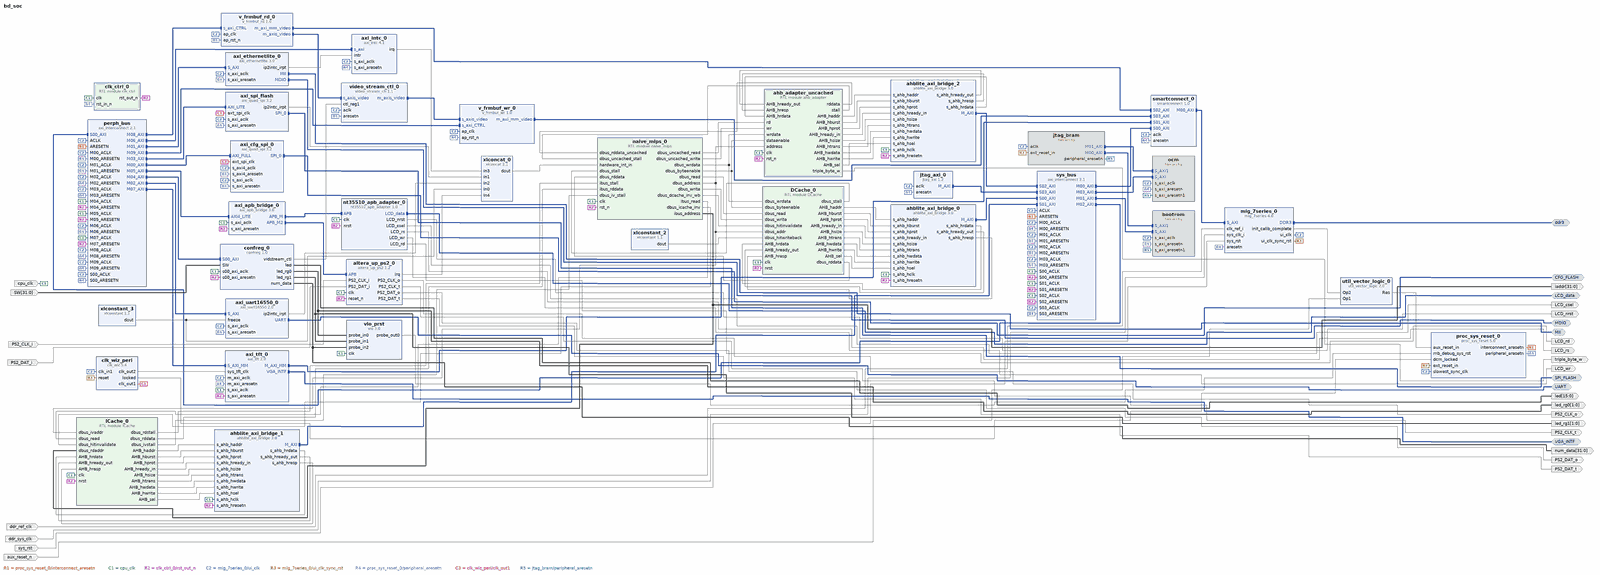
[diagram p0: block diagram of the top level, whole]
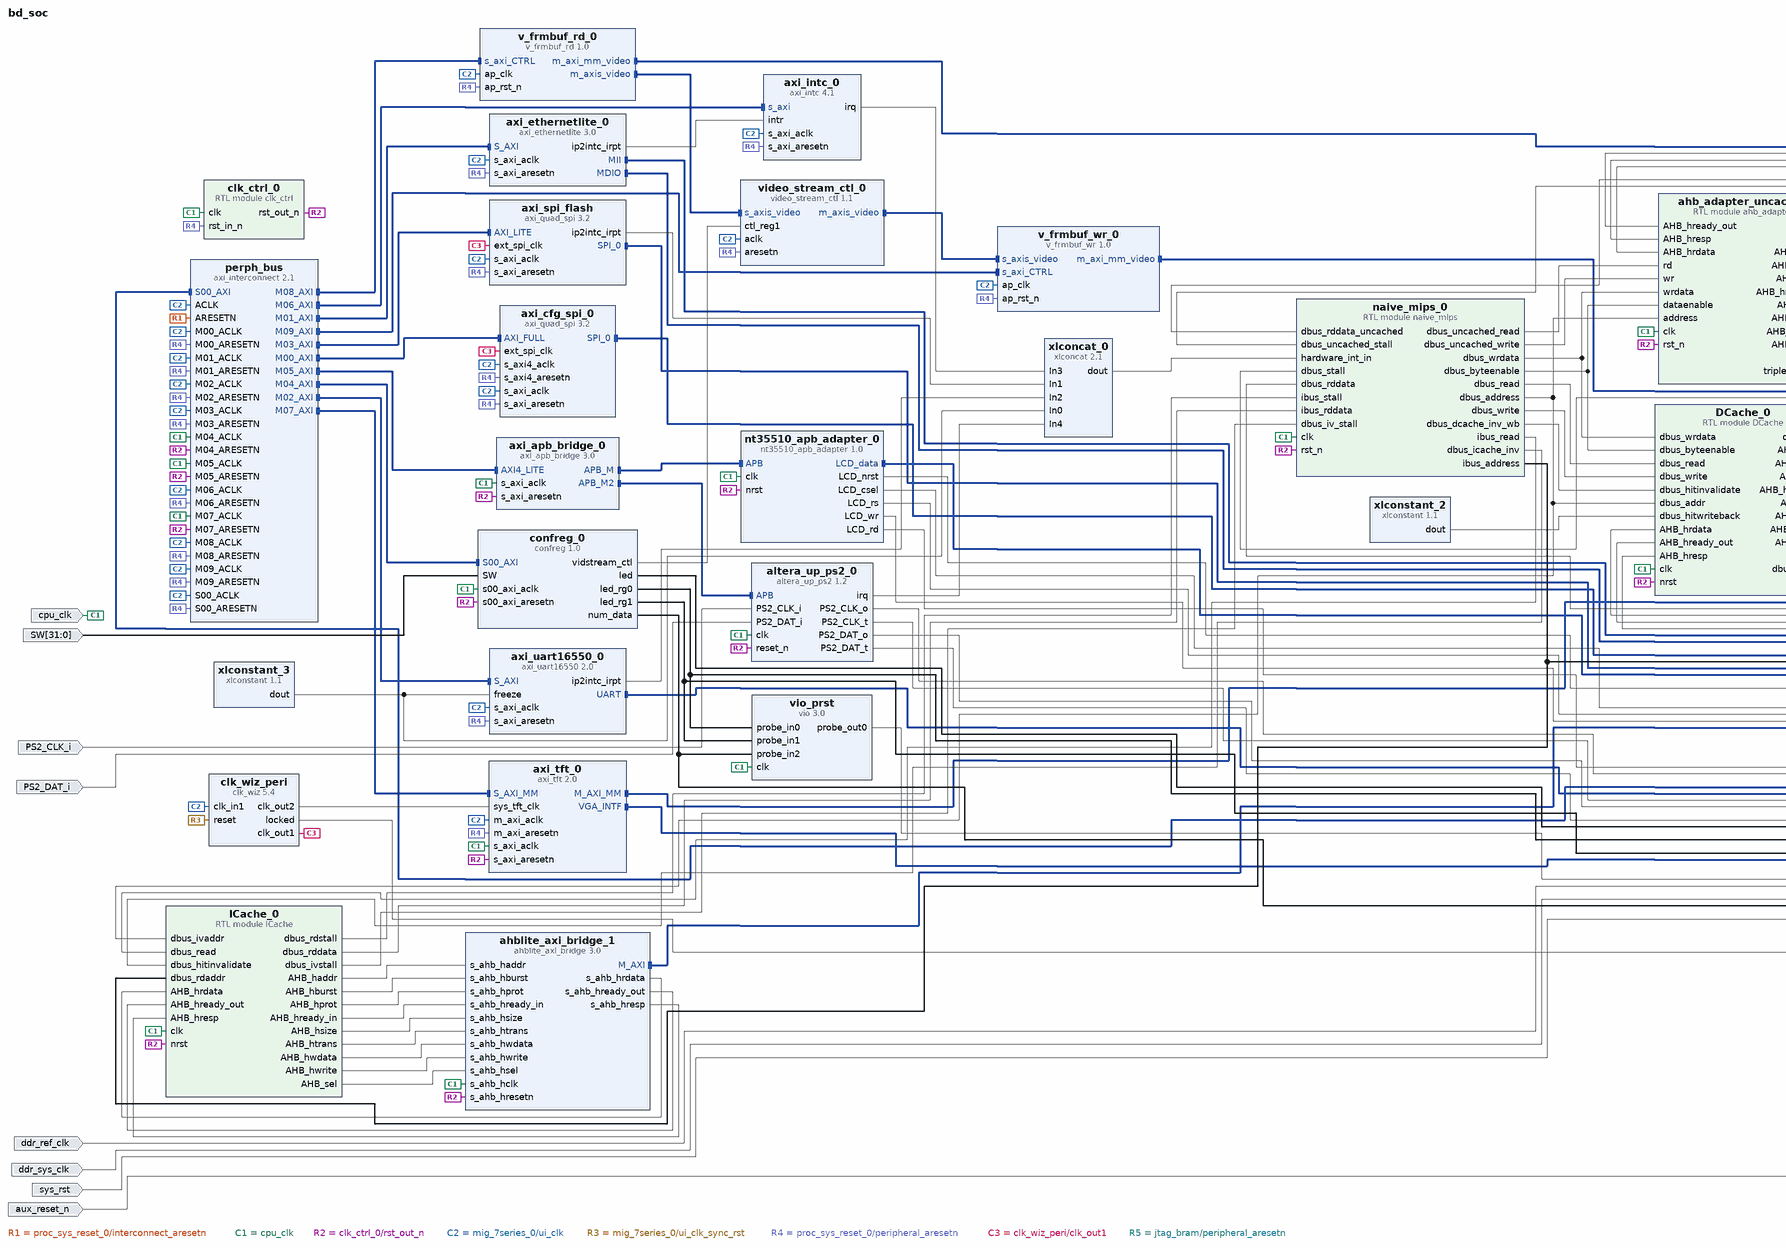
[diagram p1: block diagram of the top level, left part]
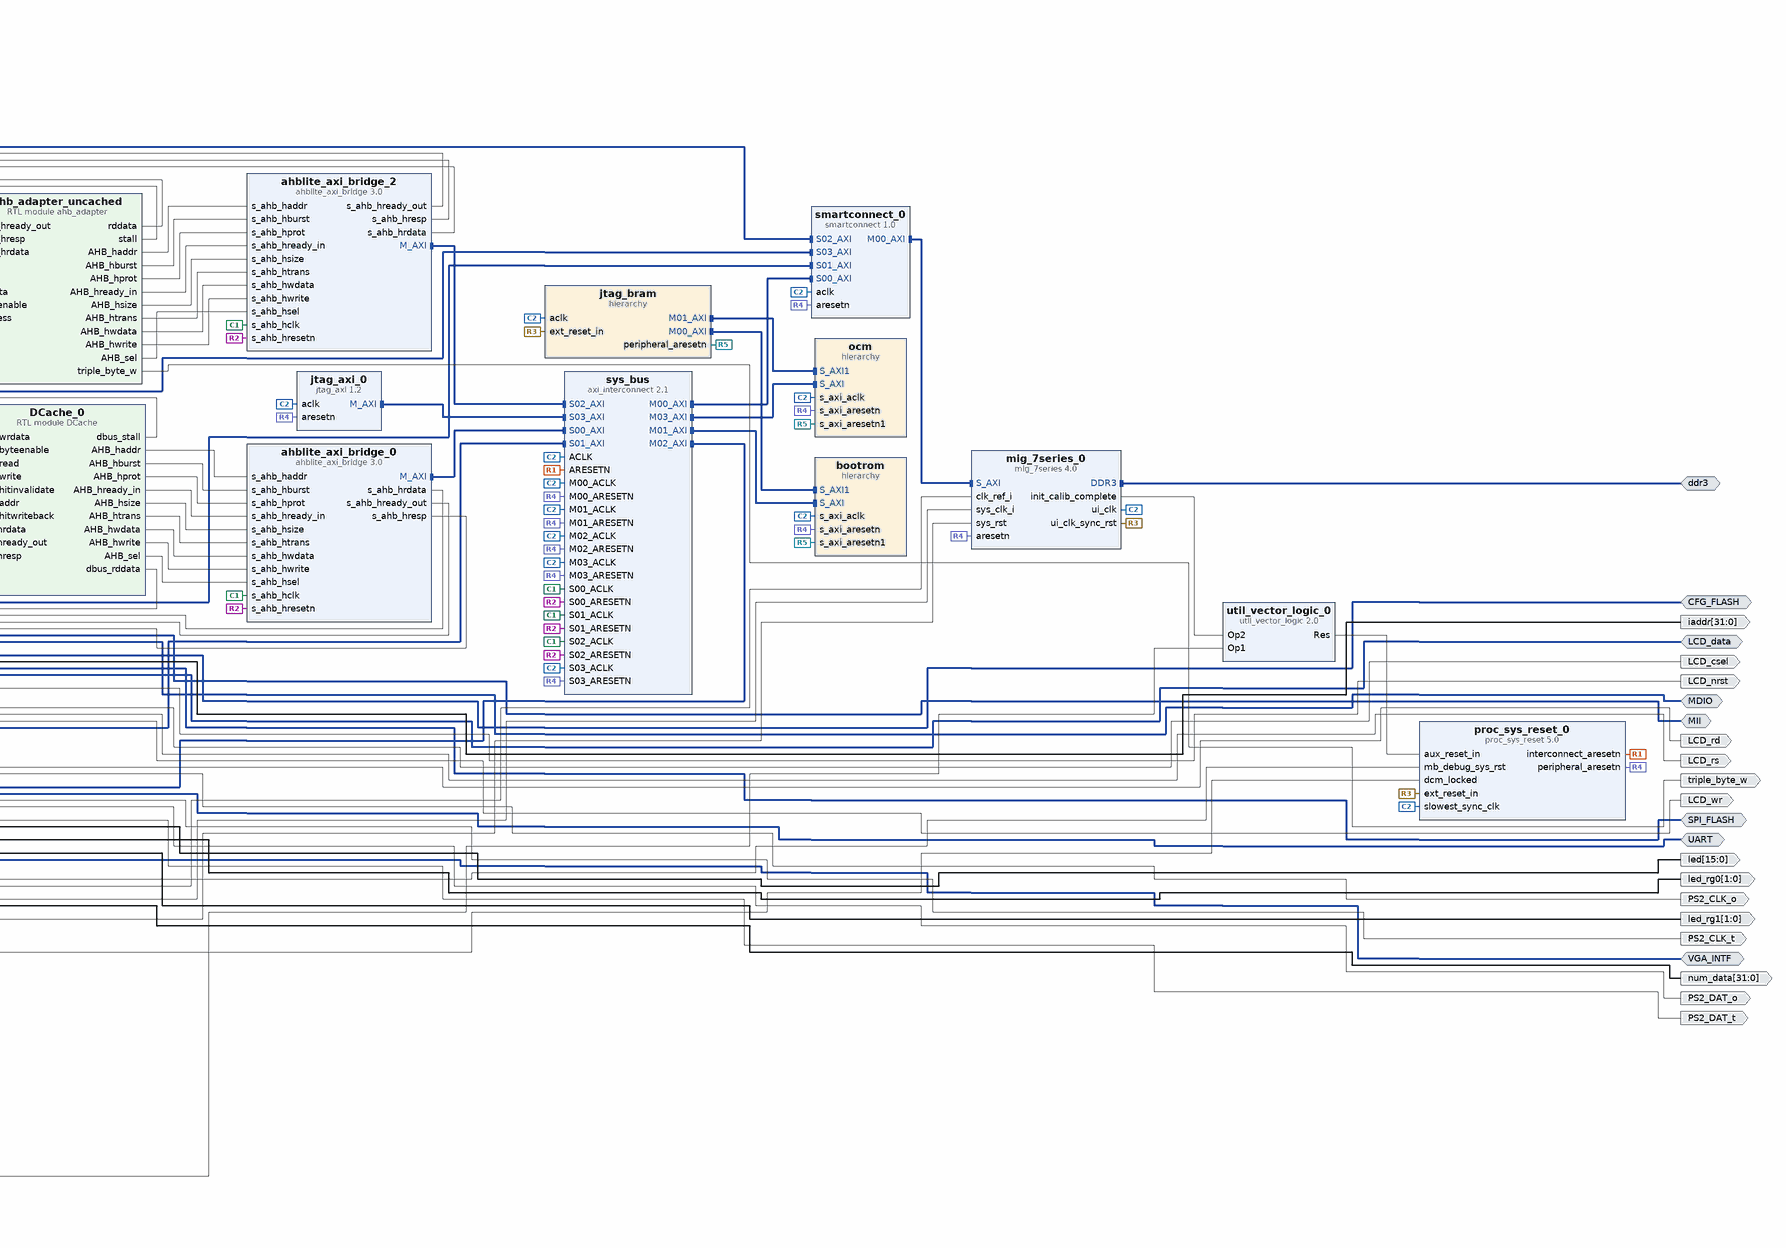
[diagram p2: block diagram of the top level, right part]
# Vivado block design bd_soc, xc7a200tfbg676-2, Vivado 2017.1
create_bd_design bd_soc

create_bd_intf_port -mode Master -vlnv xilinx.com:interface:ddrx_rtl:1.0 ddr3
create_bd_intf_port -mode Master -vlnv xilinx.com:interface:mii_rtl:1.0 MII
create_bd_intf_port -mode Master -vlnv xilinx.com:interface:mdio_rtl:1.0 MDIO
create_bd_intf_port -mode Master -vlnv xilinx.com:interface:uart_rtl:1.0 UART
create_bd_intf_port -mode Master -vlnv xilinx.com:interface:spi_rtl:1.0 SPI_FLASH
create_bd_intf_port -mode Master -vlnv xilinx.com:interface:spi_rtl:1.0 CFG_FLASH
create_bd_intf_port -mode Master -vlnv xilinx.com:interface:gpio_rtl:1.0 LCD_data
create_bd_intf_port -mode Master -vlnv xilinx.com:interface:vga_rtl:1.0 VGA_INTF
create_bd_port -dir I -type clk cpu_clk
set_property -dict {CONFIG.FREQ_HZ 50000000} [get_bd_ports cpu_clk]
create_bd_port -dir I -type clk ddr_ref_clk
set_property -dict {CONFIG.FREQ_HZ 200000000} [get_bd_ports ddr_ref_clk]
create_bd_port -dir I -type clk ddr_sys_clk
create_bd_port -dir I -type rst sys_rst
set_property -dict {CONFIG.POLARITY ACTIVE_HIGH} [get_bd_ports sys_rst]
create_bd_port -dir I -type rst aux_reset_n
create_bd_port -dir O -from 31 -to 0 iaddr
create_bd_port -dir O triple_byte_w
create_bd_port -dir O LCD_nrst
create_bd_port -dir O LCD_csel
create_bd_port -dir O LCD_rs
create_bd_port -dir O LCD_wr
create_bd_port -dir O LCD_rd
create_bd_port -dir I PS2_CLK_i
create_bd_port -dir I PS2_DAT_i
create_bd_port -dir O PS2_CLK_o
create_bd_port -dir O PS2_CLK_t
create_bd_port -dir O PS2_DAT_o
create_bd_port -dir O PS2_DAT_t
create_bd_port -dir O -from 15 -to 0 led
create_bd_port -dir O -from 1 -to 0 led_rg0
create_bd_port -dir O -from 1 -to 0 led_rg1
create_bd_port -dir O -from 31 -to 0 num_data
create_bd_port -dir I -from 31 -to 0 SW

create_bd_cell -type module -reference clk_ctrl clk_ctrl_0
create_bd_cell -type hier bootrom
create_bd_cell -type hier ocm
create_bd_cell -type hier jtag_bram
create_bd_cell -type module -reference DCache DCache_0
set_property -dict {CONFIG.CACHE_LINE_WIDTH 6 CONFIG.TAG_WIDTH 18} [get_bd_cells DCache_0]
create_bd_cell -type module -reference ICache ICache_0
set_property -dict {CONFIG.CACHE_LINE_WIDTH 6 CONFIG.TAG_WIDTH 19} [get_bd_cells ICache_0]
create_bd_cell -type module -reference ahb_adapter ahb_adapter_uncached
create_bd_cell -type ip -vlnv xilinx.com:ip:ahblite_axi_bridge:3.0 ahblite_axi_bridge_0
set_property -dict {CONFIG.C_M_AXI_THREAD_ID_WIDTH 4 CONFIG.C_M_AXI_SUPPORTS_NARROW_BURST 1} [get_bd_cells ahblite_axi_bridge_0]
create_bd_cell -type ip -vlnv xilinx.com:ip:ahblite_axi_bridge:3.0 ahblite_axi_bridge_1
set_property -dict {CONFIG.C_M_AXI_SUPPORTS_NARROW_BURST 1} [get_bd_cells ahblite_axi_bridge_1]
create_bd_cell -type ip -vlnv xilinx.com:ip:ahblite_axi_bridge:3.0 ahblite_axi_bridge_2
create_bd_cell -type ip -vlnv xilinx.com:ip:axi_apb_bridge:3.0 axi_apb_bridge_0
set_property -dict {CONFIG.C_M_APB_PROTOCOL apb4 CONFIG.C_APB_NUM_SLAVES 2} [get_bd_cells axi_apb_bridge_0]
create_bd_cell -type ip -vlnv xilinx.com:ip:axi_ethernetlite:3.0 axi_ethernetlite_0
create_bd_cell -type ip -vlnv xilinx.com:ip:axi_intc:4.1 axi_intc_0
set_property -dict {CONFIG.C_PROCESSOR_CLK_FREQ_MHZ 40.0 CONFIG.C_IRQ_CONNECTION 1} [get_bd_cells axi_intc_0]
create_bd_cell -type ip -vlnv xilinx.com:ip:axi_interconnect:2.1 perph_bus
set_property -dict [list \
  CONFIG.NUM_SI 1 \
  CONFIG.NUM_MI 10 \
  CONFIG.M00_HAS_REGSLICE 3 \
  CONFIG.M01_HAS_REGSLICE 3 \
  CONFIG.M02_HAS_REGSLICE 3 \
  CONFIG.M03_HAS_REGSLICE 3 \
  CONFIG.M04_HAS_REGSLICE 3 \
  CONFIG.M05_HAS_REGSLICE 3 \
  CONFIG.M06_HAS_REGSLICE 3 \
  CONFIG.M07_HAS_REGSLICE 3 \
  CONFIG.M08_HAS_REGSLICE 3 \
  CONFIG.M09_HAS_REGSLICE 3 \
  CONFIG.S00_HAS_REGSLICE 3 \
] [get_bd_cells perph_bus]
create_bd_cell -type ip -vlnv xilinx.com:ip:axi_interconnect:2.1 sys_bus
set_property -dict [list \
  CONFIG.NUM_SI 4 \
  CONFIG.NUM_MI 4 \
  CONFIG.STRATEGY 2 \
  CONFIG.M02_HAS_REGSLICE 3 \
  CONFIG.S03_HAS_REGSLICE 3 \
  CONFIG.S00_HAS_DATA_FIFO 2 \
  CONFIG.S01_HAS_DATA_FIFO 2 \
  CONFIG.S02_HAS_DATA_FIFO 2 \
  CONFIG.S03_HAS_DATA_FIFO 2 \
] [get_bd_cells sys_bus]
create_bd_cell -type ip -vlnv xilinx.com:ip:axi_quad_spi:3.2 axi_cfg_spi_0
set_property -dict {CONFIG.C_SPI_MEMORY 3 CONFIG.C_XIP_MODE 1 CONFIG.C_TYPE_OF_AXI4_INTERFACE 1} [get_bd_cells axi_cfg_spi_0]
create_bd_cell -type ip -vlnv xilinx.com:ip:axi_quad_spi:3.2 axi_spi_flash
set_property -dict [list \
  CONFIG.C_SPI_MEMORY 3 \
  CONFIG.C_USE_STARTUP 0 \
  CONFIG.C_SPI_MODE 2 \
  CONFIG.C_FIFO_DEPTH 256 \
  CONFIG.C_TYPE_OF_AXI4_INTERFACE 0 \
  CONFIG.C_S_AXI4_ID_WIDTH 0 \
] [get_bd_cells axi_spi_flash]
create_bd_cell -type ip -vlnv xilinx.com:ip:axi_tft:2.0 axi_tft_0
set_property -dict {CONFIG.C_MAX_BURST_LEN 128 CONFIG.C_EN_I2C_INTF 0 CONFIG.C_TFT_INTERFACE 0} [get_bd_cells axi_tft_0]
create_bd_cell -type ip -vlnv xilinx.com:ip:axi_uart16550:2.0 axi_uart16550_0
create_bd_cell -type ip -vlnv xilinx.com:ip:clk_wiz:5.4 clk_wiz_peri
set_property -dict [list \
  CONFIG.CLKOUT2_USED true \
  CONFIG.NUM_OUT_CLKS 2 \
  CONFIG.CLKOUT1_REQUESTED_OUT_FREQ 60.000 \
  CONFIG.CLKOUT2_REQUESTED_OUT_FREQ 25 \
  CONFIG.MMCM_DIVCLK_DIVIDE 1 \
  CONFIG.MMCM_CLKFBOUT_MULT_F 9.750 \
  CONFIG.MMCM_CLKOUT0_DIVIDE_F 16.250 \
  CONFIG.MMCM_CLKOUT1_DIVIDE 39 \
  CONFIG.CLKOUT1_JITTER 144.725 \
  CONFIG.CLKOUT1_PHASE_ERROR 99.281 \
  CONFIG.CLKOUT2_JITTER 174.188 \
  CONFIG.CLKOUT2_PHASE_ERROR 99.281 \
] [get_bd_cells clk_wiz_peri]
create_bd_cell -type ip -vlnv xilinx.com:ip:jtag_axi:1.2 jtag_axi_0
create_bd_cell -type ip -vlnv xilinx.com:ip:mig_7series:4.0 mig_7series_0
set_property -dict [list \
  CONFIG.XML_INPUT_FILE mig_b.prj \
  CONFIG.RESET_BOARD_INTERFACE Custom \
  CONFIG.BOARD_MIG_PARAM Custom \
] [get_bd_cells mig_7series_0]
create_bd_cell -type ip -vlnv xilinx.com:ip:proc_sys_reset:5.0 proc_sys_reset_0
set_property -dict {CONFIG.C_AUX_RESET_HIGH 0} [get_bd_cells proc_sys_reset_0]
create_bd_cell -type ip -vlnv xilinx.com:ip:util_vector_logic:2.0 util_vector_logic_0
create_bd_cell -type ip -vlnv xilinx.com:ip:vio:3.0 vio_prst
set_property -dict [list \
  CONFIG.C_PROBE_OUT0_INIT_VAL 0x0 \
  CONFIG.C_EN_PROBE_IN_ACTIVITY 0 \
  CONFIG.C_NUM_PROBE_IN 3 \
] [get_bd_cells vio_prst]
create_bd_cell -type ip -vlnv xilinx.com:ip:xlconcat:2.1 xlconcat_0
set_property -dict {CONFIG.NUM_PORTS 5 CONFIG.dout_width 5} [get_bd_cells xlconcat_0]
create_bd_cell -type ip -vlnv xilinx.com:ip:xlconstant:1.1 xlconstant_2
set_property -dict {CONFIG.CONST_VAL 0} [get_bd_cells xlconstant_2]
create_bd_cell -type ip -vlnv xilinx.com:ip:xlconstant:1.1 xlconstant_3
set_property -dict {CONFIG.CONST_VAL 0} [get_bd_cells xlconstant_3]
create_bd_cell -type ip -vlnv xilinx.com:ip:smartconnect:1.0 smartconnect_0
set_property -dict {CONFIG.NUM_SI 4} [get_bd_cells smartconnect_0]
create_bd_cell -type ip -vlnv xilinx.com:ip:v_frmbuf_rd:1.0 v_frmbuf_rd_0
set_property -dict [list \
  CONFIG.C_M_AXI_MM_VIDEO_DATA_WIDTH 64 \
  CONFIG.SAMPLES_PER_CLOCK 1 \
  CONFIG.MAX_COLS 1024 \
  CONFIG.MAX_ROWS 768 \
  CONFIG.AXIMM_DATA_WIDTH 64 \
  CONFIG.HAS_RGBX8 1 \
  CONFIG.HAS_RGB8 0 \
] [get_bd_cells v_frmbuf_rd_0]
create_bd_cell -type ip -vlnv xilinx.com:ip:v_frmbuf_wr:1.0 v_frmbuf_wr_0
set_property -dict [list \
  CONFIG.C_M_AXI_MM_VIDEO_DATA_WIDTH 64 \
  CONFIG.SAMPLES_PER_CLOCK 1 \
  CONFIG.MAX_COLS 1024 \
  CONFIG.MAX_ROWS 768 \
  CONFIG.AXIMM_DATA_WIDTH 64 \
  CONFIG.HAS_RGBX8 1 \
  CONFIG.HAS_RGB8 0 \
] [get_bd_cells v_frmbuf_wr_0]
create_bd_cell -type ip -vlnv user.org:user:confreg:1.0 confreg_0
create_bd_cell -type module -reference naive_mips naive_mips_0
set_property -dict {CONFIG.WITH_CACHE 1 CONFIG.WITH_TLB 1 CONFIG.BUS_READ_1CYCLE 1} [get_bd_cells naive_mips_0]
create_bd_cell -type ip -vlnv user.org:user:video_stream_ctl:1.1 video_stream_ctl_0
create_bd_cell -type ip -vlnv user.org:user:altera_up_ps2:1.2 altera_up_ps2_0
set_property -dict {CONFIG.CLK_FREQ 50000000} [get_bd_cells altera_up_ps2_0]
create_bd_cell -type ip -vlnv user.org:user:nt35510_apb_adapter:1.0 nt35510_apb_adapter_0

# ---- hierarchy /bootrom ----
current_bd_instance /bootrom
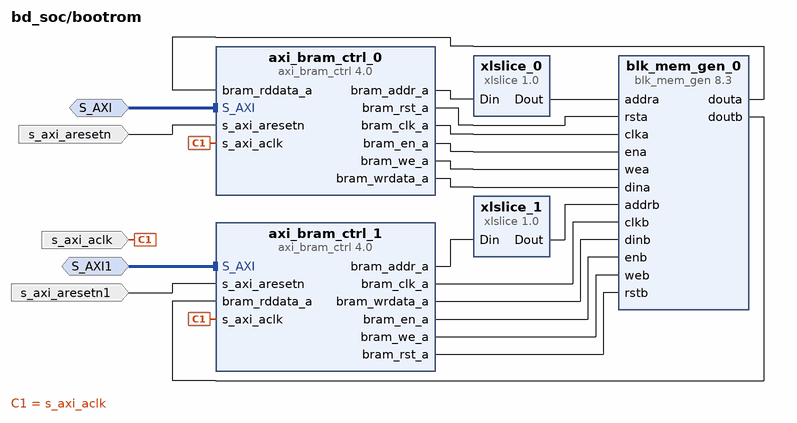
[diagram p3: block diagram inside /bootrom]
create_bd_intf_pin -mode Slave -vlnv xilinx.com:interface:aximm_rtl:1.0 S_AXI
create_bd_intf_pin -mode Slave -vlnv xilinx.com:interface:aximm_rtl:1.0 S_AXI1
create_bd_pin -dir I -type clk s_axi_aclk
create_bd_pin -dir I -type rst s_axi_aresetn
create_bd_pin -dir I -type rst s_axi_aresetn1

create_bd_cell -type ip -vlnv xilinx.com:ip:axi_bram_ctrl:4.0 axi_bram_ctrl_0
set_property -dict {CONFIG.SINGLE_PORT_BRAM 1} [get_bd_cells axi_bram_ctrl_0]
create_bd_cell -type ip -vlnv xilinx.com:ip:axi_bram_ctrl:4.0 axi_bram_ctrl_1
set_property -dict {CONFIG.SINGLE_PORT_BRAM 1} [get_bd_cells axi_bram_ctrl_1]
create_bd_cell -type ip -vlnv xilinx.com:ip:blk_mem_gen:8.3 blk_mem_gen_0
set_property -dict [list \
  CONFIG.Memory_Type True_Dual_Port_RAM \
  CONFIG.Enable_32bit_Address false \
  CONFIG.Use_Byte_Write_Enable true \
  CONFIG.Byte_Size 8 \
  CONFIG.Assume_Synchronous_Clk true \
  CONFIG.Write_Width_A 32 \
  CONFIG.Write_Depth_A 12288 \
  CONFIG.Read_Width_A 32 \
  CONFIG.Write_Width_B 32 \
  CONFIG.Read_Width_B 32 \
  CONFIG.Enable_B Use_ENB_Pin \
  CONFIG.Register_PortA_Output_of_Memory_Primitives false \
  CONFIG.Register_PortB_Output_of_Memory_Primitives false \
  CONFIG.Load_Init_File true \
  CONFIG.Coe_File ../../../../../../bootrom.coe \
  CONFIG.Fill_Remaining_Memory_Locations false \
  CONFIG.Use_RSTA_Pin true \
  CONFIG.Use_RSTB_Pin true \
  CONFIG.Port_B_Clock 100 \
  CONFIG.Port_B_Write_Rate 50 \
  CONFIG.Port_B_Enable_Rate 100 \
  CONFIG.use_bram_block Stand_Alone \
] [get_bd_cells blk_mem_gen_0]
create_bd_cell -type ip -vlnv xilinx.com:ip:xlslice:1.0 xlslice_0
set_property -dict {CONFIG.DIN_TO 2 CONFIG.DIN_FROM 15 CONFIG.DIN_WIDTH 16 CONFIG.DOUT_WIDTH 14} [get_bd_cells xlslice_0]
create_bd_cell -type ip -vlnv xilinx.com:ip:xlslice:1.0 xlslice_1
set_property -dict {CONFIG.DIN_TO 2 CONFIG.DIN_FROM 15 CONFIG.DIN_WIDTH 16 CONFIG.DOUT_WIDTH 14} [get_bd_cells xlslice_1]

# ---- hierarchy /ocm ----
current_bd_instance /ocm
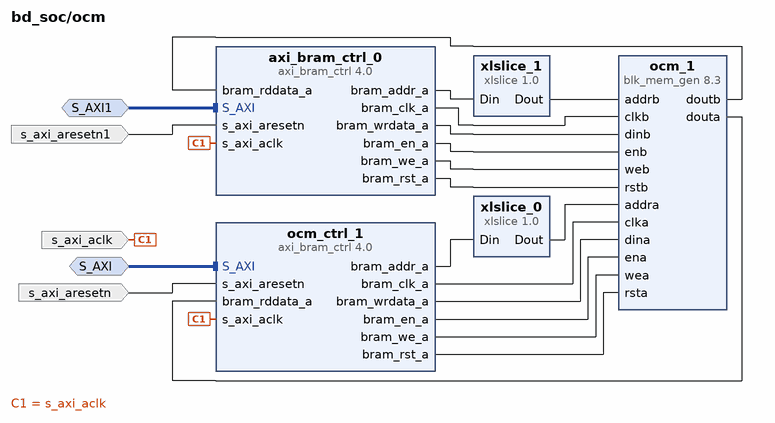
[diagram p4: block diagram inside /ocm]
create_bd_intf_pin -mode Slave -vlnv xilinx.com:interface:aximm_rtl:1.0 S_AXI
create_bd_intf_pin -mode Slave -vlnv xilinx.com:interface:aximm_rtl:1.0 S_AXI1
create_bd_pin -dir I -type clk s_axi_aclk
create_bd_pin -dir I -type rst s_axi_aresetn
create_bd_pin -dir I -type rst s_axi_aresetn1

create_bd_cell -type ip -vlnv xilinx.com:ip:axi_bram_ctrl:4.0 axi_bram_ctrl_0
set_property -dict {CONFIG.SINGLE_PORT_BRAM 1} [get_bd_cells axi_bram_ctrl_0]
create_bd_cell -type ip -vlnv xilinx.com:ip:axi_bram_ctrl:4.0 ocm_ctrl_1
set_property -dict {CONFIG.SINGLE_PORT_BRAM 1} [get_bd_cells ocm_ctrl_1]
create_bd_cell -type ip -vlnv xilinx.com:ip:blk_mem_gen:8.3 ocm_1
set_property -dict [list \
  CONFIG.Memory_Type True_Dual_Port_RAM \
  CONFIG.Enable_32bit_Address false \
  CONFIG.Use_Byte_Write_Enable true \
  CONFIG.Byte_Size 8 \
  CONFIG.Assume_Synchronous_Clk true \
  CONFIG.Write_Width_A 32 \
  CONFIG.Write_Depth_A 4096 \
  CONFIG.Read_Width_A 32 \
  CONFIG.Operating_Mode_A WRITE_FIRST \
  CONFIG.Write_Width_B 32 \
  CONFIG.Read_Width_B 32 \
  CONFIG.Enable_B Use_ENB_Pin \
  CONFIG.Register_PortA_Output_of_Memory_Primitives false \
  CONFIG.Register_PortB_Output_of_Memory_Primitives false \
  CONFIG.Use_RSTA_Pin true \
  CONFIG.Use_RSTB_Pin true \
  CONFIG.Port_B_Clock 100 \
  CONFIG.Port_B_Write_Rate 50 \
  CONFIG.Port_B_Enable_Rate 100 \
  CONFIG.use_bram_block Stand_Alone \
] [get_bd_cells ocm_1]
create_bd_cell -type ip -vlnv xilinx.com:ip:xlslice:1.0 xlslice_0
set_property -dict {CONFIG.DIN_TO 2 CONFIG.DIN_FROM 13 CONFIG.DIN_WIDTH 14 CONFIG.DOUT_WIDTH 12} [get_bd_cells xlslice_0]
create_bd_cell -type ip -vlnv xilinx.com:ip:xlslice:1.0 xlslice_1
set_property -dict {CONFIG.DIN_TO 2 CONFIG.DIN_FROM 13 CONFIG.DIN_WIDTH 14 CONFIG.DOUT_WIDTH 12} [get_bd_cells xlslice_1]

# ---- hierarchy /jtag_bram ----
current_bd_instance /jtag_bram
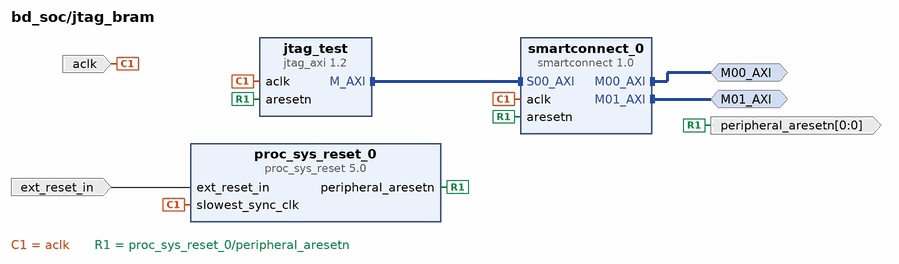
[diagram p5: block diagram inside /jtag_bram]
create_bd_intf_pin -mode Master -vlnv xilinx.com:interface:aximm_rtl:1.0 M00_AXI
create_bd_intf_pin -mode Master -vlnv xilinx.com:interface:aximm_rtl:1.0 M01_AXI
create_bd_pin -dir I -type clk aclk
create_bd_pin -dir O -from 0 -to 0 -type rst peripheral_aresetn
create_bd_pin -dir I -type rst ext_reset_in

create_bd_cell -type ip -vlnv xilinx.com:ip:jtag_axi:1.2 jtag_test
create_bd_cell -type ip -vlnv xilinx.com:ip:proc_sys_reset:5.0 proc_sys_reset_0
create_bd_cell -type ip -vlnv xilinx.com:ip:smartconnect:1.0 smartconnect_0
set_property -dict {CONFIG.NUM_MI 2 CONFIG.NUM_SI 1} [get_bd_cells smartconnect_0]

# ---- connections ----

current_bd_instance /bootrom
connect_bd_intf_net -intf_net sys_bus_M01_AXI [get_bd_intf_pins S_AXI] [get_bd_intf_pins axi_bram_ctrl_0/S_AXI]
connect_bd_intf_net [get_bd_intf_pins S_AXI1] [get_bd_intf_pins axi_bram_ctrl_1/S_AXI]
connect_bd_net [get_bd_pins axi_bram_ctrl_0/bram_rst_a] [get_bd_pins blk_mem_gen_0/rsta]
connect_bd_net [get_bd_pins axi_bram_ctrl_0/bram_clk_a] [get_bd_pins blk_mem_gen_0/clka]
connect_bd_net [get_bd_pins axi_bram_ctrl_0/bram_en_a] [get_bd_pins blk_mem_gen_0/ena]
connect_bd_net [get_bd_pins axi_bram_ctrl_0/bram_we_a] [get_bd_pins blk_mem_gen_0/wea]
connect_bd_net [get_bd_pins axi_bram_ctrl_0/bram_addr_a] [get_bd_pins xlslice_0/Din]
connect_bd_net [get_bd_pins axi_bram_ctrl_0/bram_wrdata_a] [get_bd_pins blk_mem_gen_0/dina]
connect_bd_net [get_bd_pins blk_mem_gen_0/douta] [get_bd_pins axi_bram_ctrl_0/bram_rddata_a]
connect_bd_net [get_bd_pins xlslice_0/Dout] [get_bd_pins blk_mem_gen_0/addra]
connect_bd_net -net mig_7series_0_ui_clk [get_bd_pins s_axi_aclk] [get_bd_pins axi_bram_ctrl_0/s_axi_aclk] [get_bd_pins axi_bram_ctrl_1/s_axi_aclk]
connect_bd_net -net proc_sys_reset_0_peripheral_aresetn [get_bd_pins s_axi_aresetn] [get_bd_pins axi_bram_ctrl_0/s_axi_aresetn]
connect_bd_net [get_bd_pins axi_bram_ctrl_1/bram_addr_a] [get_bd_pins xlslice_1/Din]
connect_bd_net [get_bd_pins xlslice_1/Dout] [get_bd_pins blk_mem_gen_0/addrb]
connect_bd_net [get_bd_pins axi_bram_ctrl_1/bram_clk_a] [get_bd_pins blk_mem_gen_0/clkb]
connect_bd_net [get_bd_pins axi_bram_ctrl_1/bram_wrdata_a] [get_bd_pins blk_mem_gen_0/dinb]
connect_bd_net [get_bd_pins blk_mem_gen_0/doutb] [get_bd_pins axi_bram_ctrl_1/bram_rddata_a]
connect_bd_net [get_bd_pins axi_bram_ctrl_1/bram_en_a] [get_bd_pins blk_mem_gen_0/enb]
connect_bd_net [get_bd_pins axi_bram_ctrl_1/bram_we_a] [get_bd_pins blk_mem_gen_0/web]
connect_bd_net -net s_axi_aresetn1_1 [get_bd_pins s_axi_aresetn1] [get_bd_pins axi_bram_ctrl_1/s_axi_aresetn]
connect_bd_net [get_bd_pins axi_bram_ctrl_1/bram_rst_a] [get_bd_pins blk_mem_gen_0/rstb]

current_bd_instance /ocm
connect_bd_intf_net -intf_net sys_bus_M03_AXI [get_bd_intf_pins S_AXI] [get_bd_intf_pins ocm_ctrl_1/S_AXI]
connect_bd_intf_net [get_bd_intf_pins S_AXI1] [get_bd_intf_pins axi_bram_ctrl_0/S_AXI]
connect_bd_net -net mig_7series_0_ui_clk [get_bd_pins s_axi_aclk] [get_bd_pins axi_bram_ctrl_0/s_axi_aclk] [get_bd_pins ocm_ctrl_1/s_axi_aclk]
connect_bd_net -net proc_sys_reset_0_peripheral_aresetn [get_bd_pins s_axi_aresetn] [get_bd_pins ocm_ctrl_1/s_axi_aresetn]
connect_bd_net [get_bd_pins ocm_ctrl_1/bram_addr_a] [get_bd_pins xlslice_0/Din]
connect_bd_net [get_bd_pins xlslice_0/Dout] [get_bd_pins ocm_1/addra]
connect_bd_net [get_bd_pins ocm_ctrl_1/bram_clk_a] [get_bd_pins ocm_1/clka]
connect_bd_net [get_bd_pins ocm_ctrl_1/bram_wrdata_a] [get_bd_pins ocm_1/dina]
connect_bd_net [get_bd_pins ocm_1/douta] [get_bd_pins ocm_ctrl_1/bram_rddata_a]
connect_bd_net [get_bd_pins ocm_ctrl_1/bram_en_a] [get_bd_pins ocm_1/ena]
connect_bd_net [get_bd_pins ocm_ctrl_1/bram_we_a] [get_bd_pins ocm_1/wea]
connect_bd_net [get_bd_pins axi_bram_ctrl_0/bram_addr_a] [get_bd_pins xlslice_1/Din]
connect_bd_net [get_bd_pins xlslice_1/Dout] [get_bd_pins ocm_1/addrb]
connect_bd_net [get_bd_pins axi_bram_ctrl_0/bram_clk_a] [get_bd_pins ocm_1/clkb]
connect_bd_net [get_bd_pins axi_bram_ctrl_0/bram_wrdata_a] [get_bd_pins ocm_1/dinb]
connect_bd_net [get_bd_pins ocm_1/doutb] [get_bd_pins axi_bram_ctrl_0/bram_rddata_a]
connect_bd_net [get_bd_pins axi_bram_ctrl_0/bram_en_a] [get_bd_pins ocm_1/enb]
connect_bd_net [get_bd_pins axi_bram_ctrl_0/bram_we_a] [get_bd_pins ocm_1/web]
connect_bd_net -net s_axi_aresetn1_1 [get_bd_pins s_axi_aresetn1] [get_bd_pins axi_bram_ctrl_0/s_axi_aresetn]
connect_bd_net [get_bd_pins ocm_ctrl_1/bram_rst_a] [get_bd_pins ocm_1/rsta]
connect_bd_net [get_bd_pins axi_bram_ctrl_0/bram_rst_a] [get_bd_pins ocm_1/rstb]

current_bd_instance /jtag_bram
connect_bd_intf_net [get_bd_intf_pins jtag_test/M_AXI] [get_bd_intf_pins smartconnect_0/S00_AXI]
connect_bd_intf_net [get_bd_intf_pins M00_AXI] [get_bd_intf_pins smartconnect_0/M00_AXI]
connect_bd_intf_net [get_bd_intf_pins M01_AXI] [get_bd_intf_pins smartconnect_0/M01_AXI]
connect_bd_net -net mig_7series_0_ui_clk [get_bd_pins aclk] \
  [get_bd_pins jtag_test/aclk] [get_bd_pins proc_sys_reset_0/slowest_sync_clk] [get_bd_pins smartconnect_0/aclk]
connect_bd_net [get_bd_pins proc_sys_reset_0/peripheral_aresetn] \
  [get_bd_pins peripheral_aresetn] [get_bd_pins jtag_test/aresetn] [get_bd_pins smartconnect_0/aresetn]
connect_bd_net [get_bd_pins ext_reset_in] [get_bd_pins proc_sys_reset_0/ext_reset_in]

current_bd_instance /
connect_bd_intf_net -intf_net axi_interconnect_0_M01_AXI [get_bd_intf_pins perph_bus/M01_AXI] [get_bd_intf_pins axi_ethernetlite_0/S_AXI]
connect_bd_intf_net -intf_net axi_interconnect_1_M02_AXI [get_bd_intf_pins sys_bus/M02_AXI] [get_bd_intf_pins perph_bus/S00_AXI]
connect_bd_intf_net [get_bd_intf_pins ahblite_axi_bridge_0/M_AXI] [get_bd_intf_pins sys_bus/S00_AXI]
connect_bd_intf_net [get_bd_intf_pins ahblite_axi_bridge_1/M_AXI] [get_bd_intf_pins sys_bus/S01_AXI]
connect_bd_intf_net [get_bd_intf_pins bootrom/S_AXI] [get_bd_intf_pins sys_bus/M01_AXI]
connect_bd_intf_net [get_bd_intf_pins axi_cfg_spi_0/AXI_FULL] [get_bd_intf_pins perph_bus/M00_AXI]
connect_bd_intf_net [get_bd_intf_pins ahblite_axi_bridge_2/M_AXI] [get_bd_intf_pins sys_bus/S02_AXI]
connect_bd_intf_net [get_bd_intf_pins axi_uart16550_0/S_AXI] [get_bd_intf_pins perph_bus/M02_AXI]
connect_bd_intf_net [get_bd_intf_pins axi_apb_bridge_0/AXI4_LITE] [get_bd_intf_pins perph_bus/M05_AXI]
connect_bd_intf_net [get_bd_intf_pins nt35510_apb_adapter_0/APB] [get_bd_intf_pins axi_apb_bridge_0/APB_M]
connect_bd_intf_net [get_bd_intf_pins perph_bus/M06_AXI] [get_bd_intf_pins axi_intc_0/s_axi]
connect_bd_intf_net [get_bd_intf_pins axi_spi_flash/AXI_LITE] [get_bd_intf_pins perph_bus/M03_AXI]
connect_bd_intf_net [get_bd_intf_pins perph_bus/M07_AXI] [get_bd_intf_pins axi_tft_0/S_AXI_MM]
connect_bd_intf_net [get_bd_intf_pins axi_apb_bridge_0/APB_M2] [get_bd_intf_pins altera_up_ps2_0/APB]
connect_bd_intf_net [get_bd_intf_pins confreg_0/S00_AXI] [get_bd_intf_pins perph_bus/M04_AXI]
connect_bd_intf_net [get_bd_intf_pins ocm/S_AXI] [get_bd_intf_pins sys_bus/M03_AXI]
connect_bd_intf_net -intf_net smartconnect_0_M01_AXI [get_bd_intf_pins jtag_bram/M01_AXI] [get_bd_intf_pins ocm/S_AXI1]
connect_bd_intf_net -intf_net smartconnect_0_M00_AXI [get_bd_intf_pins jtag_bram/M00_AXI] [get_bd_intf_pins bootrom/S_AXI1]
connect_bd_intf_net [get_bd_intf_pins jtag_axi_0/M_AXI] [get_bd_intf_pins sys_bus/S03_AXI]
connect_bd_intf_net [get_bd_intf_pins smartconnect_0/M00_AXI] [get_bd_intf_pins mig_7series_0/S_AXI]
connect_bd_intf_net [get_bd_intf_pins smartconnect_0/S00_AXI] [get_bd_intf_pins sys_bus/M00_AXI]
connect_bd_intf_net [get_bd_intf_pins smartconnect_0/S01_AXI] [get_bd_intf_pins axi_tft_0/M_AXI_MM]
connect_bd_intf_net [get_bd_intf_pins v_frmbuf_rd_0/m_axi_mm_video] [get_bd_intf_pins smartconnect_0/S02_AXI]
connect_bd_intf_net [get_bd_intf_pins v_frmbuf_wr_0/m_axi_mm_video] [get_bd_intf_pins smartconnect_0/S03_AXI]
connect_bd_intf_net [get_bd_intf_pins v_frmbuf_rd_0/s_axi_CTRL] [get_bd_intf_pins perph_bus/M08_AXI]
connect_bd_intf_net [get_bd_intf_pins v_frmbuf_wr_0/s_axi_CTRL] [get_bd_intf_pins perph_bus/M09_AXI]
connect_bd_intf_net [get_bd_intf_pins v_frmbuf_rd_0/m_axis_video] [get_bd_intf_pins video_stream_ctl_0/s_axis_video]
connect_bd_intf_net [get_bd_intf_pins video_stream_ctl_0/m_axis_video] [get_bd_intf_pins v_frmbuf_wr_0/s_axis_video]
connect_bd_intf_net [get_bd_intf_ports ddr3] [get_bd_intf_pins mig_7series_0/DDR3]
connect_bd_intf_net [get_bd_intf_ports MII] [get_bd_intf_pins axi_ethernetlite_0/MII]
connect_bd_intf_net [get_bd_intf_ports MDIO] [get_bd_intf_pins axi_ethernetlite_0/MDIO]
connect_bd_intf_net [get_bd_intf_ports UART] [get_bd_intf_pins axi_uart16550_0/UART]
connect_bd_intf_net [get_bd_intf_ports SPI_FLASH] [get_bd_intf_pins axi_spi_flash/SPI_0]
connect_bd_intf_net [get_bd_intf_ports CFG_FLASH] [get_bd_intf_pins axi_cfg_spi_0/SPI_0]
connect_bd_intf_net [get_bd_intf_ports LCD_data] [get_bd_intf_pins nt35510_apb_adapter_0/LCD_data]
connect_bd_intf_net [get_bd_intf_ports VGA_INTF] [get_bd_intf_pins axi_tft_0/VGA_INTF]
connect_bd_net -net ARESETN_1 [get_bd_pins proc_sys_reset_0/interconnect_aresetn] [get_bd_pins perph_bus/ARESETN] [get_bd_pins sys_bus/ARESETN]
connect_bd_net -net S00_ACLK_1 [get_bd_ports cpu_clk] \
  [get_bd_pins clk_ctrl_0/clk] [get_bd_pins DCache_0/clk] [get_bd_pins ICache_0/clk] [get_bd_pins ahb_adapter_uncached/clk] \
  [get_bd_pins ahblite_axi_bridge_0/s_ahb_hclk] [get_bd_pins ahblite_axi_bridge_1/s_ahb_hclk] \
  [get_bd_pins ahblite_axi_bridge_2/s_ahb_hclk] [get_bd_pins vio_prst/clk] [get_bd_pins axi_apb_bridge_0/s_axi_aclk] \
  [get_bd_pins axi_tft_0/s_axi_aclk] [get_bd_pins confreg_0/s00_axi_aclk] [get_bd_pins naive_mips_0/clk] \
  [get_bd_pins perph_bus/M04_ACLK] [get_bd_pins sys_bus/S00_ACLK] [get_bd_pins sys_bus/S01_ACLK] \
  [get_bd_pins sys_bus/S02_ACLK] [get_bd_pins perph_bus/M05_ACLK] [get_bd_pins perph_bus/M07_ACLK] \
  [get_bd_pins altera_up_ps2_0/clk] [get_bd_pins nt35510_apb_adapter_0/clk]
connect_bd_net -net S00_ARESETN_1 [get_bd_pins clk_ctrl_0/rst_out_n] \
  [get_bd_pins DCache_0/nrst] [get_bd_pins ICache_0/nrst] [get_bd_pins ahb_adapter_uncached/rst_n] \
  [get_bd_pins ahblite_axi_bridge_0/s_ahb_hresetn] [get_bd_pins ahblite_axi_bridge_1/s_ahb_hresetn] \
  [get_bd_pins ahblite_axi_bridge_2/s_ahb_hresetn] [get_bd_pins axi_apb_bridge_0/s_axi_aresetn] \
  [get_bd_pins axi_tft_0/s_axi_aresetn] [get_bd_pins confreg_0/s00_axi_aresetn] [get_bd_pins naive_mips_0/rst_n] \
  [get_bd_pins perph_bus/M04_ARESETN] [get_bd_pins sys_bus/S00_ARESETN] [get_bd_pins sys_bus/S01_ARESETN] \
  [get_bd_pins sys_bus/S02_ARESETN] [get_bd_pins perph_bus/M05_ARESETN] [get_bd_pins perph_bus/M07_ARESETN] \
  [get_bd_pins altera_up_ps2_0/reset_n] [get_bd_pins nt35510_apb_adapter_0/nrst]
connect_bd_net -net clk_ref_i_1 [get_bd_ports ddr_ref_clk] [get_bd_pins mig_7series_0/clk_ref_i]
connect_bd_net [get_bd_pins mig_7series_0/init_calib_complete] [get_bd_pins util_vector_logic_0/Op2]
connect_bd_net [get_bd_pins mig_7series_0/ui_clk] \
  [get_bd_pins axi_ethernetlite_0/s_axi_aclk] [get_bd_pins axi_intc_0/s_axi_aclk] [get_bd_pins axi_cfg_spi_0/s_axi_aclk] \
  [get_bd_pins axi_cfg_spi_0/s_axi4_aclk] [get_bd_pins axi_spi_flash/s_axi_aclk] [get_bd_pins axi_tft_0/m_axi_aclk] \
  [get_bd_pins axi_uart16550_0/s_axi_aclk] [get_bd_pins clk_wiz_peri/clk_in1] [get_bd_pins jtag_axi_0/aclk] \
  [get_bd_pins proc_sys_reset_0/slowest_sync_clk] [get_bd_pins smartconnect_0/aclk] [get_bd_pins v_frmbuf_rd_0/ap_clk] \
  [get_bd_pins v_frmbuf_wr_0/ap_clk] [get_bd_pins video_stream_ctl_0/aclk] [get_bd_pins bootrom/s_axi_aclk] \
  [get_bd_pins ocm/s_axi_aclk] [get_bd_pins jtag_bram/aclk] [get_bd_pins perph_bus/ACLK] [get_bd_pins perph_bus/S00_ACLK] \
  [get_bd_pins perph_bus/M00_ACLK] [get_bd_pins perph_bus/M01_ACLK] [get_bd_pins perph_bus/M02_ACLK] \
  [get_bd_pins perph_bus/M03_ACLK] [get_bd_pins perph_bus/M06_ACLK] [get_bd_pins sys_bus/ACLK] [get_bd_pins sys_bus/M00_ACLK] \
  [get_bd_pins sys_bus/M01_ACLK] [get_bd_pins sys_bus/M02_ACLK] [get_bd_pins sys_bus/M03_ACLK] [get_bd_pins sys_bus/S03_ACLK] \
  [get_bd_pins perph_bus/M08_ACLK] [get_bd_pins perph_bus/M09_ACLK]
connect_bd_net [get_bd_pins mig_7series_0/ui_clk_sync_rst] \
  [get_bd_pins clk_wiz_peri/reset] [get_bd_pins proc_sys_reset_0/ext_reset_in] [get_bd_pins jtag_bram/ext_reset_in]
connect_bd_net [get_bd_pins proc_sys_reset_0/peripheral_aresetn] \
  [get_bd_pins clk_ctrl_0/rst_in_n] [get_bd_pins axi_ethernetlite_0/s_axi_aresetn] [get_bd_pins axi_intc_0/s_axi_aresetn] \
  [get_bd_pins axi_cfg_spi_0/s_axi_aresetn] [get_bd_pins axi_cfg_spi_0/s_axi4_aresetn] \
  [get_bd_pins axi_spi_flash/s_axi_aresetn] [get_bd_pins axi_tft_0/m_axi_aresetn] [get_bd_pins axi_uart16550_0/s_axi_aresetn] \
  [get_bd_pins jtag_axi_0/aresetn] [get_bd_pins mig_7series_0/aresetn] [get_bd_pins smartconnect_0/aresetn] \
  [get_bd_pins v_frmbuf_rd_0/ap_rst_n] [get_bd_pins v_frmbuf_wr_0/ap_rst_n] [get_bd_pins video_stream_ctl_0/aresetn] \
  [get_bd_pins bootrom/s_axi_aresetn] [get_bd_pins ocm/s_axi_aresetn] [get_bd_pins perph_bus/S00_ARESETN] \
  [get_bd_pins perph_bus/M00_ARESETN] [get_bd_pins perph_bus/M01_ARESETN] [get_bd_pins perph_bus/M02_ARESETN] \
  [get_bd_pins perph_bus/M03_ARESETN] [get_bd_pins perph_bus/M06_ARESETN] [get_bd_pins sys_bus/M00_ARESETN] \
  [get_bd_pins sys_bus/M01_ARESETN] [get_bd_pins sys_bus/M02_ARESETN] [get_bd_pins sys_bus/M03_ARESETN] \
  [get_bd_pins sys_bus/S03_ARESETN] [get_bd_pins perph_bus/M08_ARESETN] [get_bd_pins perph_bus/M09_ARESETN]
connect_bd_net -net sys_clk_i_1 [get_bd_ports ddr_sys_clk] [get_bd_pins mig_7series_0/sys_clk_i]
connect_bd_net [get_bd_ports sys_rst] [get_bd_pins mig_7series_0/sys_rst]
connect_bd_net [get_bd_pins axi_spi_flash/ip2intc_irpt] [get_bd_pins xlconcat_0/In1]
connect_bd_net -net ext_spi_clk_1 [get_bd_pins clk_wiz_peri/clk_out1] [get_bd_pins axi_cfg_spi_0/ext_spi_clk] [get_bd_pins axi_spi_flash/ext_spi_clk]
connect_bd_net [get_bd_pins DCache_0/AHB_haddr] [get_bd_pins ahblite_axi_bridge_0/s_ahb_haddr]
connect_bd_net [get_bd_pins DCache_0/AHB_hburst] [get_bd_pins ahblite_axi_bridge_0/s_ahb_hburst]
connect_bd_net [get_bd_pins DCache_0/AHB_hprot] [get_bd_pins ahblite_axi_bridge_0/s_ahb_hprot]
connect_bd_net [get_bd_pins DCache_0/AHB_hready_in] [get_bd_pins ahblite_axi_bridge_0/s_ahb_hready_in]
connect_bd_net [get_bd_pins DCache_0/AHB_hsize] [get_bd_pins ahblite_axi_bridge_0/s_ahb_hsize]
connect_bd_net [get_bd_pins DCache_0/AHB_htrans] [get_bd_pins ahblite_axi_bridge_0/s_ahb_htrans]
connect_bd_net [get_bd_pins DCache_0/AHB_hwdata] [get_bd_pins ahblite_axi_bridge_0/s_ahb_hwdata]
connect_bd_net [get_bd_pins DCache_0/AHB_hwrite] [get_bd_pins ahblite_axi_bridge_0/s_ahb_hwrite]
connect_bd_net [get_bd_pins DCache_0/AHB_sel] [get_bd_pins ahblite_axi_bridge_0/s_ahb_hsel]
connect_bd_net [get_bd_pins ahblite_axi_bridge_0/s_ahb_hrdata] [get_bd_pins DCache_0/AHB_hrdata]
connect_bd_net [get_bd_pins ahblite_axi_bridge_0/s_ahb_hready_out] [get_bd_pins DCache_0/AHB_hready_out]
connect_bd_net [get_bd_pins ahblite_axi_bridge_0/s_ahb_hresp] [get_bd_pins DCache_0/AHB_hresp]
connect_bd_net [get_bd_pins naive_mips_0/dbus_read] [get_bd_pins DCache_0/dbus_read]
connect_bd_net [get_bd_pins naive_mips_0/dbus_write] [get_bd_pins DCache_0/dbus_write]
connect_bd_net [get_bd_pins naive_mips_0/dbus_wrdata] [get_bd_pins DCache_0/dbus_wrdata] [get_bd_pins ahb_adapter_uncached/wrdata]
connect_bd_net [get_bd_pins naive_mips_0/dbus_dcache_inv_wb] [get_bd_pins DCache_0/dbus_hitinvalidate]
connect_bd_net [get_bd_pins naive_mips_0/dbus_byteenable] [get_bd_pins DCache_0/dbus_byteenable] [get_bd_pins ahb_adapter_uncached/dataenable]
connect_bd_net [get_bd_pins naive_mips_0/dbus_address] \
  [get_bd_pins DCache_0/dbus_addr] [get_bd_pins ICache_0/dbus_ivaddr] [get_bd_pins ahb_adapter_uncached/address]
connect_bd_net [get_bd_pins DCache_0/dbus_stall] [get_bd_pins naive_mips_0/dbus_stall]
connect_bd_net [get_bd_pins DCache_0/dbus_rddata] [get_bd_pins naive_mips_0/dbus_rddata]
connect_bd_net [get_bd_pins xlconcat_0/dout] [get_bd_pins naive_mips_0/hardware_int_in]
connect_bd_net -net aux_reset_in_1 [get_bd_ports aux_reset_n] [get_bd_pins util_vector_logic_0/Op1]
connect_bd_net [get_bd_pins naive_mips_0/dbus_uncached_read] [get_bd_pins ahb_adapter_uncached/rd]
connect_bd_net [get_bd_pins naive_mips_0/dbus_uncached_write] [get_bd_pins ahb_adapter_uncached/wr]
connect_bd_net [get_bd_pins ahb_adapter_uncached/rddata] [get_bd_pins naive_mips_0/dbus_rddata_uncached]
connect_bd_net [get_bd_pins ahb_adapter_uncached/stall] [get_bd_pins naive_mips_0/dbus_uncached_stall]
connect_bd_net [get_bd_pins ahb_adapter_uncached/AHB_haddr] [get_bd_pins ahblite_axi_bridge_2/s_ahb_haddr]
connect_bd_net [get_bd_pins ahb_adapter_uncached/AHB_hburst] [get_bd_pins ahblite_axi_bridge_2/s_ahb_hburst]
connect_bd_net [get_bd_pins ahb_adapter_uncached/AHB_hprot] [get_bd_pins ahblite_axi_bridge_2/s_ahb_hprot]
connect_bd_net [get_bd_pins ahb_adapter_uncached/AHB_hready_in] [get_bd_pins ahblite_axi_bridge_2/s_ahb_hready_in]
connect_bd_net [get_bd_pins ahblite_axi_bridge_2/s_ahb_hready_out] [get_bd_pins ahb_adapter_uncached/AHB_hready_out]
connect_bd_net [get_bd_pins ahblite_axi_bridge_2/s_ahb_hresp] [get_bd_pins ahb_adapter_uncached/AHB_hresp]
connect_bd_net [get_bd_pins ahblite_axi_bridge_2/s_ahb_hrdata] [get_bd_pins ahb_adapter_uncached/AHB_hrdata]
connect_bd_net [get_bd_pins ahb_adapter_uncached/AHB_hsize] [get_bd_pins ahblite_axi_bridge_2/s_ahb_hsize]
connect_bd_net [get_bd_pins ahb_adapter_uncached/AHB_htrans] [get_bd_pins ahblite_axi_bridge_2/s_ahb_htrans]
connect_bd_net [get_bd_pins ahb_adapter_uncached/AHB_hwdata] [get_bd_pins ahblite_axi_bridge_2/s_ahb_hwdata]
connect_bd_net [get_bd_pins ahb_adapter_uncached/AHB_hwrite] [get_bd_pins ahblite_axi_bridge_2/s_ahb_hwrite]
connect_bd_net [get_bd_pins ahb_adapter_uncached/AHB_sel] [get_bd_pins ahblite_axi_bridge_2/s_ahb_hsel]
connect_bd_net [get_bd_pins xlconstant_2/dout] [get_bd_pins DCache_0/dbus_hitwriteback]
connect_bd_net [get_bd_pins xlconstant_3/dout] [get_bd_pins axi_uart16550_0/freeze] [get_bd_pins xlconcat_0/In0]
connect_bd_net [get_bd_pins ICache_0/dbus_rdstall] [get_bd_pins naive_mips_0/ibus_stall]
connect_bd_net [get_bd_pins ICache_0/dbus_rddata] [get_bd_pins naive_mips_0/ibus_rddata]
connect_bd_net [get_bd_pins naive_mips_0/ibus_read] [get_bd_pins ICache_0/dbus_read]
connect_bd_net [get_bd_pins naive_mips_0/ibus_address] [get_bd_ports iaddr] [get_bd_pins ICache_0/dbus_rdaddr]
connect_bd_net [get_bd_pins naive_mips_0/dbus_icache_inv] [get_bd_pins ICache_0/dbus_hitinvalidate]
connect_bd_net [get_bd_pins ICache_0/AHB_haddr] [get_bd_pins ahblite_axi_bridge_1/s_ahb_haddr]
connect_bd_net [get_bd_pins ICache_0/AHB_hburst] [get_bd_pins ahblite_axi_bridge_1/s_ahb_hburst]
connect_bd_net [get_bd_pins ICache_0/AHB_hprot] [get_bd_pins ahblite_axi_bridge_1/s_ahb_hprot]
connect_bd_net [get_bd_pins ahblite_axi_bridge_1/s_ahb_hrdata] [get_bd_pins ICache_0/AHB_hrdata]
connect_bd_net [get_bd_pins ahblite_axi_bridge_1/s_ahb_hready_out] [get_bd_pins ICache_0/AHB_hready_out]
connect_bd_net [get_bd_pins ICache_0/AHB_hready_in] [get_bd_pins ahblite_axi_bridge_1/s_ahb_hready_in]
connect_bd_net [get_bd_pins ICache_0/AHB_hsize] [get_bd_pins ahblite_axi_bridge_1/s_ahb_hsize]
connect_bd_net [get_bd_pins ahblite_axi_bridge_1/s_ahb_hresp] [get_bd_pins ICache_0/AHB_hresp]
connect_bd_net [get_bd_pins ICache_0/AHB_htrans] [get_bd_pins ahblite_axi_bridge_1/s_ahb_htrans]
connect_bd_net [get_bd_pins ICache_0/AHB_hwdata] [get_bd_pins ahblite_axi_bridge_1/s_ahb_hwdata]
connect_bd_net [get_bd_pins ICache_0/AHB_hwrite] [get_bd_pins ahblite_axi_bridge_1/s_ahb_hwrite]
connect_bd_net [get_bd_pins ICache_0/AHB_sel] [get_bd_pins ahblite_axi_bridge_1/s_ahb_hsel]
connect_bd_net [get_bd_pins ICache_0/dbus_ivstall] [get_bd_pins naive_mips_0/dbus_iv_stall]
connect_bd_net [get_bd_pins axi_uart16550_0/ip2intc_irpt] [get_bd_pins xlconcat_0/In2]
connect_bd_net [get_bd_pins ahb_adapter_uncached/triple_byte_w] [get_bd_ports triple_byte_w]
connect_bd_net [get_bd_pins nt35510_apb_adapter_0/LCD_nrst] [get_bd_ports LCD_nrst]
connect_bd_net [get_bd_pins nt35510_apb_adapter_0/LCD_csel] [get_bd_ports LCD_csel]
connect_bd_net [get_bd_pins nt35510_apb_adapter_0/LCD_rs] [get_bd_ports LCD_rs]
connect_bd_net [get_bd_pins nt35510_apb_adapter_0/LCD_wr] [get_bd_ports LCD_wr]
connect_bd_net [get_bd_pins nt35510_apb_adapter_0/LCD_rd] [get_bd_ports LCD_rd]
connect_bd_net [get_bd_pins axi_ethernetlite_0/ip2intc_irpt] [get_bd_pins axi_intc_0/intr]
connect_bd_net [get_bd_pins axi_intc_0/irq] [get_bd_pins xlconcat_0/In3]
connect_bd_net [get_bd_pins clk_wiz_peri/clk_out2] [get_bd_pins axi_tft_0/sys_tft_clk]
connect_bd_net [get_bd_pins altera_up_ps2_0/irq] [get_bd_pins xlconcat_0/In4]
connect_bd_net [get_bd_ports PS2_CLK_i] [get_bd_pins altera_up_ps2_0/PS2_CLK_i]
connect_bd_net [get_bd_ports PS2_DAT_i] [get_bd_pins altera_up_ps2_0/PS2_DAT_i]
connect_bd_net [get_bd_pins altera_up_ps2_0/PS2_CLK_o] [get_bd_ports PS2_CLK_o]
connect_bd_net [get_bd_pins altera_up_ps2_0/PS2_CLK_t] [get_bd_ports PS2_CLK_t]
connect_bd_net [get_bd_pins altera_up_ps2_0/PS2_DAT_o] [get_bd_ports PS2_DAT_o]
connect_bd_net [get_bd_pins altera_up_ps2_0/PS2_DAT_t] [get_bd_ports PS2_DAT_t]
connect_bd_net [get_bd_pins confreg_0/led] [get_bd_ports led]
connect_bd_net [get_bd_pins confreg_0/led_rg0] [get_bd_ports led_rg0] [get_bd_pins vio_prst/probe_in0]
connect_bd_net [get_bd_pins confreg_0/led_rg1] [get_bd_ports led_rg1] [get_bd_pins vio_prst/probe_in1]
connect_bd_net [get_bd_pins confreg_0/num_data] [get_bd_ports num_data] [get_bd_pins vio_prst/probe_in2]
connect_bd_net [get_bd_ports SW] [get_bd_pins confreg_0/SW]
connect_bd_net -net vio_0_probe_out0 [get_bd_pins vio_prst/probe_out0] [get_bd_pins proc_sys_reset_0/mb_debug_sys_rst]
connect_bd_net [get_bd_pins util_vector_logic_0/Res] [get_bd_pins proc_sys_reset_0/aux_reset_in]
connect_bd_net [get_bd_pins clk_wiz_peri/locked] [get_bd_pins proc_sys_reset_0/dcm_locked]
connect_bd_net [get_bd_pins jtag_bram/peripheral_aresetn] [get_bd_pins ocm/s_axi_aresetn1] [get_bd_pins bootrom/s_axi_aresetn1]
connect_bd_net [get_bd_pins confreg_0/vidstream_ctl] [get_bd_pins video_stream_ctl_0/ctl_reg1]

# ---- address map ----
assign_bd_address -offset 0x00000000 -range 128M -target_address_space [get_bd_addr_spaces axi_tft_0/Video_data] [get_bd_addr_segs mig_7series_0/memmap/memaddr]
assign_bd_address -offset 0x00000000 -range 128M -target_address_space [get_bd_addr_spaces jtag_axi_0/Data] [get_bd_addr_segs mig_7series_0/memmap/memaddr]
assign_bd_address -offset 0x08000000 -range 16K -target_address_space [get_bd_addr_spaces jtag_axi_0/Data] [get_bd_addr_segs ocm/ocm_ctrl_1/S_AXI/Mem0]
assign_bd_address -offset 0x1A000000 -range 16M -target_address_space [get_bd_addr_spaces jtag_axi_0/Data] [get_bd_addr_segs axi_cfg_spi_0/aximm/MEM0]
assign_bd_address -offset 0x1C030000 -range 64K -target_address_space [get_bd_addr_spaces jtag_axi_0/Data] [get_bd_addr_segs axi_ethernetlite_0/S_AXI/Reg]
assign_bd_address -offset 0x1C060000 -range 4K -target_address_space [get_bd_addr_spaces jtag_axi_0/Data] [get_bd_addr_segs nt35510_apb_adapter_0/APB/Ctrl]
assign_bd_address -offset 0x1C062000 -range 4K -target_address_space [get_bd_addr_spaces jtag_axi_0/Data] [get_bd_addr_segs altera_up_ps2_0/APB/ctl]
assign_bd_address -offset 0x1C080000 -range 4K -target_address_space [get_bd_addr_spaces jtag_axi_0/Data] [get_bd_addr_segs axi_intc_0/S_AXI/Reg]
assign_bd_address -offset 0x1C090000 -range 4K -target_address_space [get_bd_addr_spaces jtag_axi_0/Data] [get_bd_addr_segs axi_tft_0/S_AXI_MM/Reg]
assign_bd_address -offset 0x1C091000 -range 4K -target_address_space [get_bd_addr_spaces jtag_axi_0/Data] [get_bd_addr_segs v_frmbuf_rd_0/s_axi_CTRL/Reg]
assign_bd_address -offset 0x1C092000 -range 4K -target_address_space [get_bd_addr_spaces jtag_axi_0/Data] [get_bd_addr_segs v_frmbuf_wr_0/s_axi_CTRL/Reg]
assign_bd_address -offset 0x1E000000 -range 4K -target_address_space [get_bd_addr_spaces jtag_axi_0/Data] [get_bd_addr_segs axi_spi_flash/AXI_LITE/Reg]
assign_bd_address -offset 0x1FC00000 -range 64K -target_address_space [get_bd_addr_spaces jtag_axi_0/Data] [get_bd_addr_segs bootrom/axi_bram_ctrl_0/S_AXI/Mem0]
assign_bd_address -offset 0x1FD02000 -range 8K -target_address_space [get_bd_addr_spaces jtag_axi_0/Data] [get_bd_addr_segs axi_uart16550_0/S_AXI/Reg]
assign_bd_address -offset 0x1FD0E000 -range 8K -target_address_space [get_bd_addr_spaces jtag_axi_0/Data] [get_bd_addr_segs confreg_0/S00_AXI/S00_AXI_reg]
assign_bd_address -offset 0x00000000 -range 64K -target_address_space [get_bd_addr_spaces jtag_bram/jtag_test/Data] [get_bd_addr_segs bootrom/axi_bram_ctrl_1/S_AXI/Mem0]
assign_bd_address -offset 0x10000000 -range 16K -target_address_space [get_bd_addr_spaces jtag_bram/jtag_test/Data] [get_bd_addr_segs ocm/axi_bram_ctrl_0/S_AXI/Mem0]
assign_bd_address -offset 0x00000000 -range 128M -target_address_space [get_bd_addr_spaces v_frmbuf_rd_0/Data_m_axi_mm_video] [get_bd_addr_segs mig_7series_0/memmap/memaddr]
assign_bd_address -offset 0x00000000 -range 128M -target_address_space [get_bd_addr_spaces v_frmbuf_wr_0/Data_m_axi_mm_video] [get_bd_addr_segs mig_7series_0/memmap/memaddr]

validate_bd_design
save_bd_design
